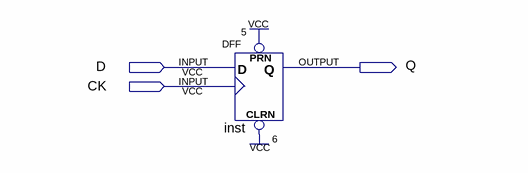
[diagram p0: schematic sheet]
// Quartus schematic dffom.bdf as structural Verilog: 1 symbols, 3 pins
module dffom (
  input  D,
  input  CK,
  output Q
);

  DFF inst (.CLRN(1'b1), .CLK(CK), .D(D), .PRN(1'b1), .Q(Q));
endmodule
